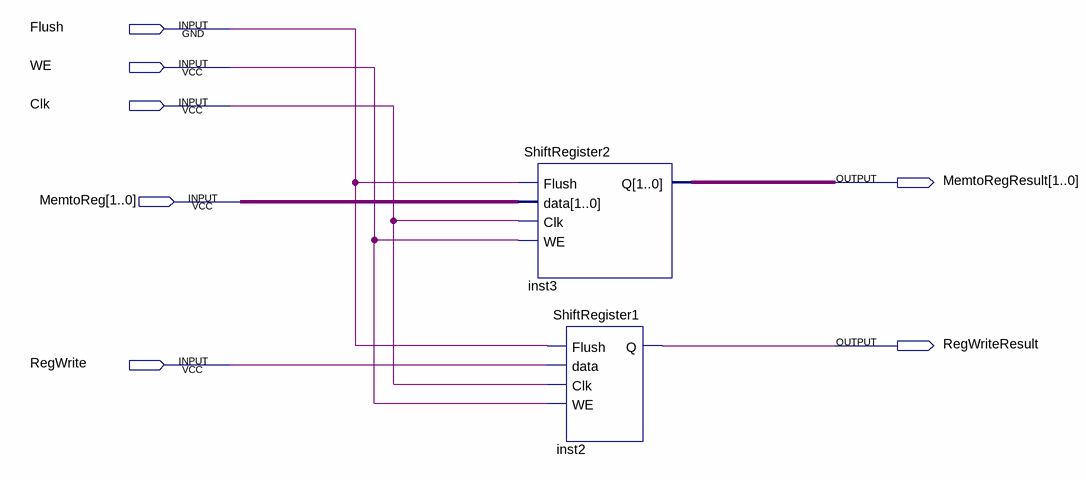
[diagram p0: schematic sheet]
// Quartus schematic WB_Register.bdf as structural Verilog: 2 symbols, 7 pins
module WB_Register (
  input  Flush,
  input  WE,
  input  Clk,
  input  [1:0] MemtoReg,
  input  RegWrite,
  output [1:0] MemtoRegResult,
  output RegWriteResult
);

  ShiftRegister2 inst3 (.Flush(Flush), .data(MemtoReg), .Clk(Clk), .WE(WE), .Q(MemtoRegResult));
  ShiftRegister1 inst2 (.Flush(Flush), .data(RegWrite), .Clk(Clk), .WE(WE), .Q(RegWriteResult));
endmodule
